# EAGLE design tqfp_0_8mm_breakout (EAGLE 6.5.0)
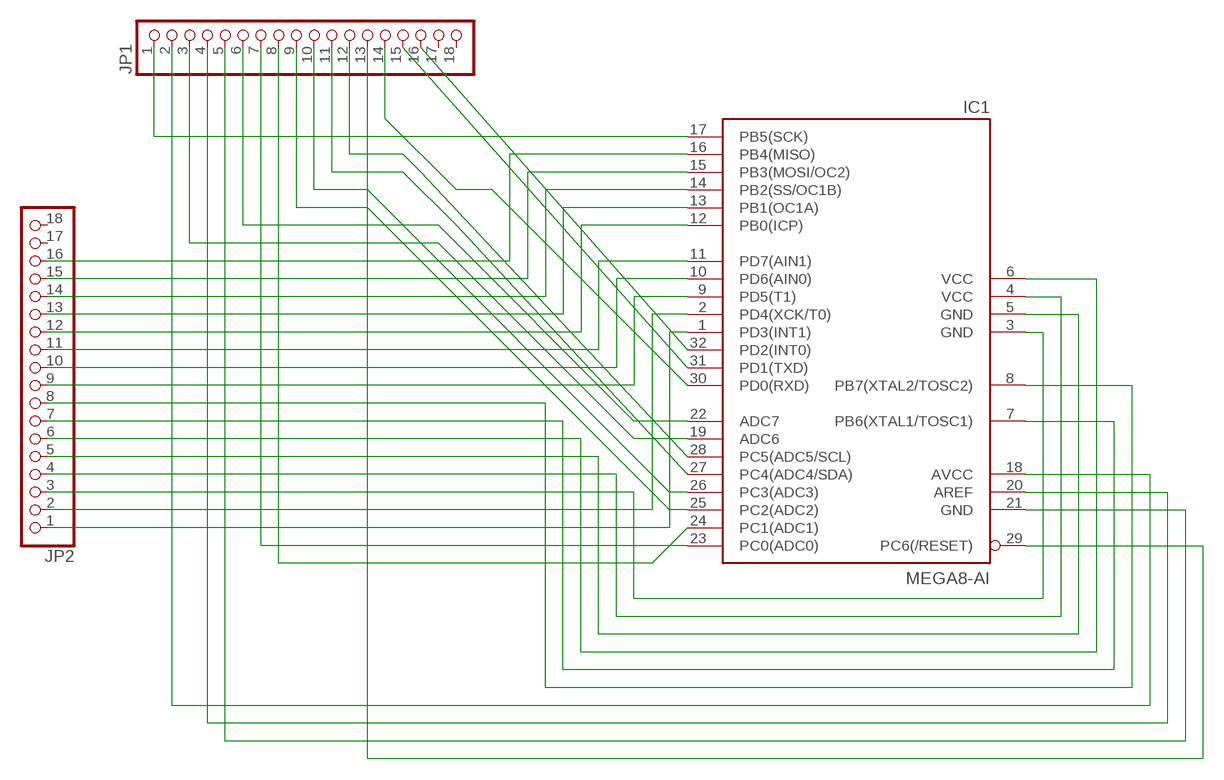
[diagram p0: schematic, sheet 1]

## Parts
IC1  MEGA8-AI  [TQFP32-08]
JP1  PINHD-1X18  [1X18]
JP2  PINHD-1X18  [1X18]

## Nets
N$1: IC1.1(PD3(INT1)) JP2.1
N$2: IC1.2(PD4(XCK/T0)) JP2.2
N$3: IC1.3(GND) JP2.3
N$4: IC1.4(VCC) JP2.4
N$5: IC1.5(GND) JP2.5
N$6: IC1.6(VCC) JP2.6
N$7: IC1.7(PB6(XTAL1/TOSC1)) JP2.7
N$8: IC1.8(PB7(XTAL2/TOSC2)) JP2.8
N$9: IC1.9(PD5(T1)) JP2.9
N$10: IC1.10(PD6(AIN0)) JP2.10
N$11: IC1.11(PD7(AIN1)) JP2.11
N$12: IC1.12(PB0(ICP)) JP2.12
N$13: IC1.13(PB1(OC1A)) JP2.13
N$14: IC1.14(PB2(SS/OC1B)) JP2.14
N$15: IC1.15(PB3(MOSI/OC2)) JP2.15
N$16: IC1.16(PB4(MISO)) JP2.16
N$17: IC1.17(PB5(SCK)) JP1.1
N$18: IC1.18(AVCC) JP1.2
N$19: IC1.19(ADC6) JP1.3
N$20: IC1.20(AREF) JP1.4
N$21: IC1.21(GND) JP1.5
N$22: IC1.22(ADC7) JP1.6
N$23: IC1.23(PC0(ADC0)) JP1.7
N$24: IC1.24(PC1(ADC1)) JP1.8
N$25: IC1.25(PC2(ADC2)) JP1.9
N$26: IC1.26(PC3(ADC3)) JP1.10
N$27: IC1.27(PC4(ADC4/SDA)) JP1.11
N$28: IC1.28(PC5(ADC5/SCL)) JP1.12
N$29: IC1.29(PC6(/RESET)) JP1.13
N$30: IC1.30(PD0(RXD)) JP1.14
N$31: IC1.31(PD1(TXD)) JP1.15
N$32: IC1.32(PD2(INT0)) JP1.16
Unconnected: JP1.17 JP1.18 JP2.17 JP2.18

## Library data of the parts
IC1 = atmel:MEGA8: MICROCONTROLLER 8 Kbytes FLASH, 1 kbytes SRAM, 512 bytes EEPROM, USART, 6-channel 10 bit ADC, 2-channel 8 bit ADC Pin compatible with Atmega48, ATMega88, ATMega168 Source: avr.lbr; MPN: ATMEGA8-16AU; OC_FARNELL: 9171371; OC_NEWARK: 73M8863
JP1 JP2 = adafruit:PINHD-1X18: PIN HEADER

## Board
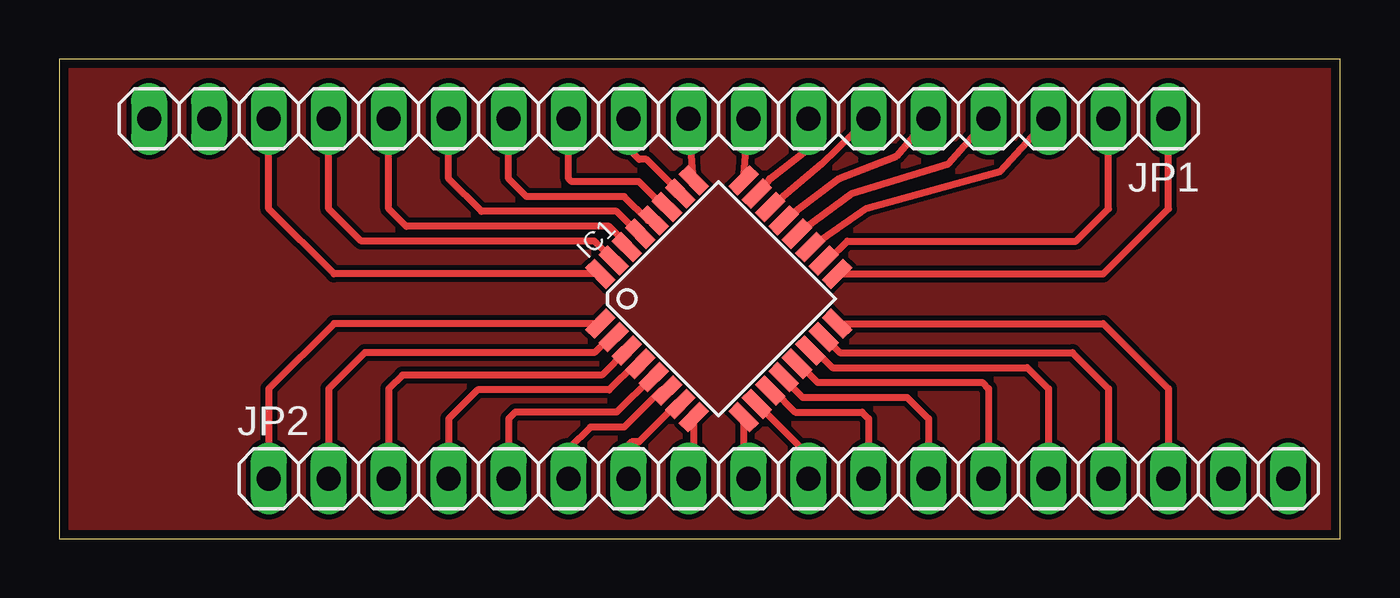
[diagram p1: board, top side]

Size 54.28 x 20.31 mm. Coordinates in mm from the lower left corner, seen from the top.
Outline: 0,0 54.28,0 54.28,20.31 0,20.31 0,0
Copper layers (1*16): Top 0.0178mm / dielectric 59mil / Bottom 0.0178mm
Design rules "epl-lpkf *": minimum track width 8mil, minimum drill 0.35mm, track to track 8mil, track to pad 8mil, pad to pad 8mil, via to via 8mil, smd to smd 8mil, copper to edge 15mil, drill to drill 15mil, minimum pad ring 8mil, minimum via ring 8mil, stop-mask expansion 3mil, vias tented up to drill 0mil, thermal gap 10mil

### Footprints (pad centres in the part's own frame; a part is rotated, then mirrored left to right if it is on the bottom)
TQFP32-08 = smd 1.27 x 0.559: 1 -4.293,2.8; 2 -4.293,2; 3 -4.293,1.2; 4 -4.293,0.4; 5 -4.293,-0.4; 6 -4.293,-1.2; 7 -4.293,-2; 8 -4.293,-2.8; 17 4.293,-2.8; 18 4.293,-2; 19 4.293,-1.2; 20 4.293,-0.4; 21 4.293,0.4; 22 4.293,1.2; 23 4.293,2; 24 4.293,2.8 | smd 0.559 x 1.27: 9 -2.8,-4.293; 10 -2,-4.293; 11 -1.2,-4.293; 12 -0.4,-4.293; 13 0.4,-4.293; 14 1.2,-4.293; 15 2,-4.293; 16 2.8,-4.293; 25 2.8,4.293; 26 2,4.293; 27 1.2,4.293; 28 0.4,4.293; 29 -0.4,4.293; 30 -1.2,4.293; 31 -2,4.293; 32 -2.8,4.293
1X18 = drill 1.016 long: 1 -21.59,0; 2 -19.05,0; 3 -16.51,0; 4 -13.97,0; 5 -11.43,0; 6 -8.89,0; 7 -6.35,0; 8 -3.81,0; 9 -1.27,0; 10 1.27,0; 11 3.81,0; 12 6.35,0; 13 8.89,0; 14 11.43,0; 15 13.97,0; 16 16.51,0; 17 19.05,0; 18 21.59,0

### Placement (x,y rotation side)
IC1  27.94,10.16 45 top
JP1  25.4,17.78 180 top
JP2  30.48,2.54 0 top

### Tracks (layer width: path | path; a pad name or v marks a point on that pad's centre or on a via)
N$1
  Top 0.305: IC1.1 11.64,9.11 8.89,6.35 JP2.1
N$2
  Top 0.305: IC1.2 23.34,8.54 22.68,7.87 12.95,7.87 11.43,6.35 JP2.2
N$3
  Top 0.305: IC1.3 24.04,7.97 22.99,6.93 14.55,6.93 13.97,6.35 JP2.3
N$4
  Top 0.305: IC1.4 24.41,7.41 23.31,6.3 17.73,6.3 16.51,5.08 JP2.4
N$5
  Top 0.305: IC1.5 25.11,6.84 23.62,5.35 19.32,5.35 19.05,5.08 JP2.5
N$6
  Top 0.305: IC1.6 25.49,6.28 23.94,4.72 22.5,4.72 21.59,3.81 JP2.6
N$7
  Top 0.305: IC1.7 26.18,5.71 24.57,4.09 24.25,4.09 23.94,3.78 23.94,2.73 JP2.7
N$8
  Top 0.305: IC1.8 26.89,2.75 JP2.8
N$9
  Top 0.305: IC1.9 29,2.75 JP2.9
N$10
  Top 0.305: IC1.10 31.81,3.46 31.81,2.6 JP2.10
N$11
  Top 0.305: IC1.11 30.26,6.28 31.18,5.35 34.02,5.35 34.29,5.08 JP2.11
N$12
  Top 0.305: IC1.12 30.69,6.79 31.5,5.98 35.93,5.98 36.83,5.08 JP2.12
N$13
  Top 0.305: IC1.13 31.33,7.41 32.13,6.61 39.11,6.61 39.37,6.35 JP2.13
N$14
  Top 0.305: IC1.14 32.03,7.97 32.76,7.24 41.02,7.24 41.91,6.35 JP2.14
N$15
  Top 0.305: IC1.15 32.41,8.54 33.07,7.87 42.93,7.87 44.45,6.35 JP2.15
N$16
  Top 0.305: IC1.16 44.23,9.11 46.99,6.35 JP2.16
N$17
  Top 0.305: IC1.17 44.23,11.21 46.99,13.97 JP1.1
N$18
  Top 0.305: IC1.18 32.57,11.78 33.39,12.6 43.08,12.6 44.45,13.97 JP1.2
N$19
  Top 0.305: IC1.19 34.21,13.99 39.88,15.56 JP1.3
N$20
  Top 0.305: IC1.20 33.58,14.62 37.67,15.88 JP1.4
N$21
  Top 0.305: IC1.21 33.02,15.24 35.47,16.2 JP1.5
N$22
  Top 0.305: IC1.22 32.32,15.88 JP1.6
N$23
  Top 0.305: IC1.23 30.11,15.25 31.75,16.51 JP1.7
N$24
  Top 0.305: IC1.24 JP1.8
N$25
  Top 0.305: IC1.25 JP1.9
N$26
  Top 0.305: IC1.26 26.32,14.63 24.88,16.06 24.58,16.06 24.13,16.51 JP1.10
N$27
  Top 0.305: IC1.27 25.64,14.04 24.57,15.12 21.71,15.12 21.59,15.24 JP1.11
N$28
  Top 0.305: IC1.28 24.95,13.48 23.94,14.49 19.8,14.49 19.05,15.24 JP1.12
N$29
  Top 0.305: IC1.29 24.57,12.91 23.62,13.86 17.89,13.86 16.51,15.24 JP1.13
N$30
  Top 0.305: IC1.30 24.06,12.48 23.31,13.23 14.71,13.23 13.97,13.97 JP1.14
N$31
  Top 0.305: IC1.31 22.68,12.6 12.8,12.6 11.43,13.97 JP1.15
N$32
  Top 0.305: IC1.32 11.64,11.21 8.89,13.97 JP1.16
N$33
  pour Top: 0,20.32 54.61,20.32 54.61,0 0,0